# EAGLE design Mother_Board (EAGLE 6.3)

## Sheet 1 of 2
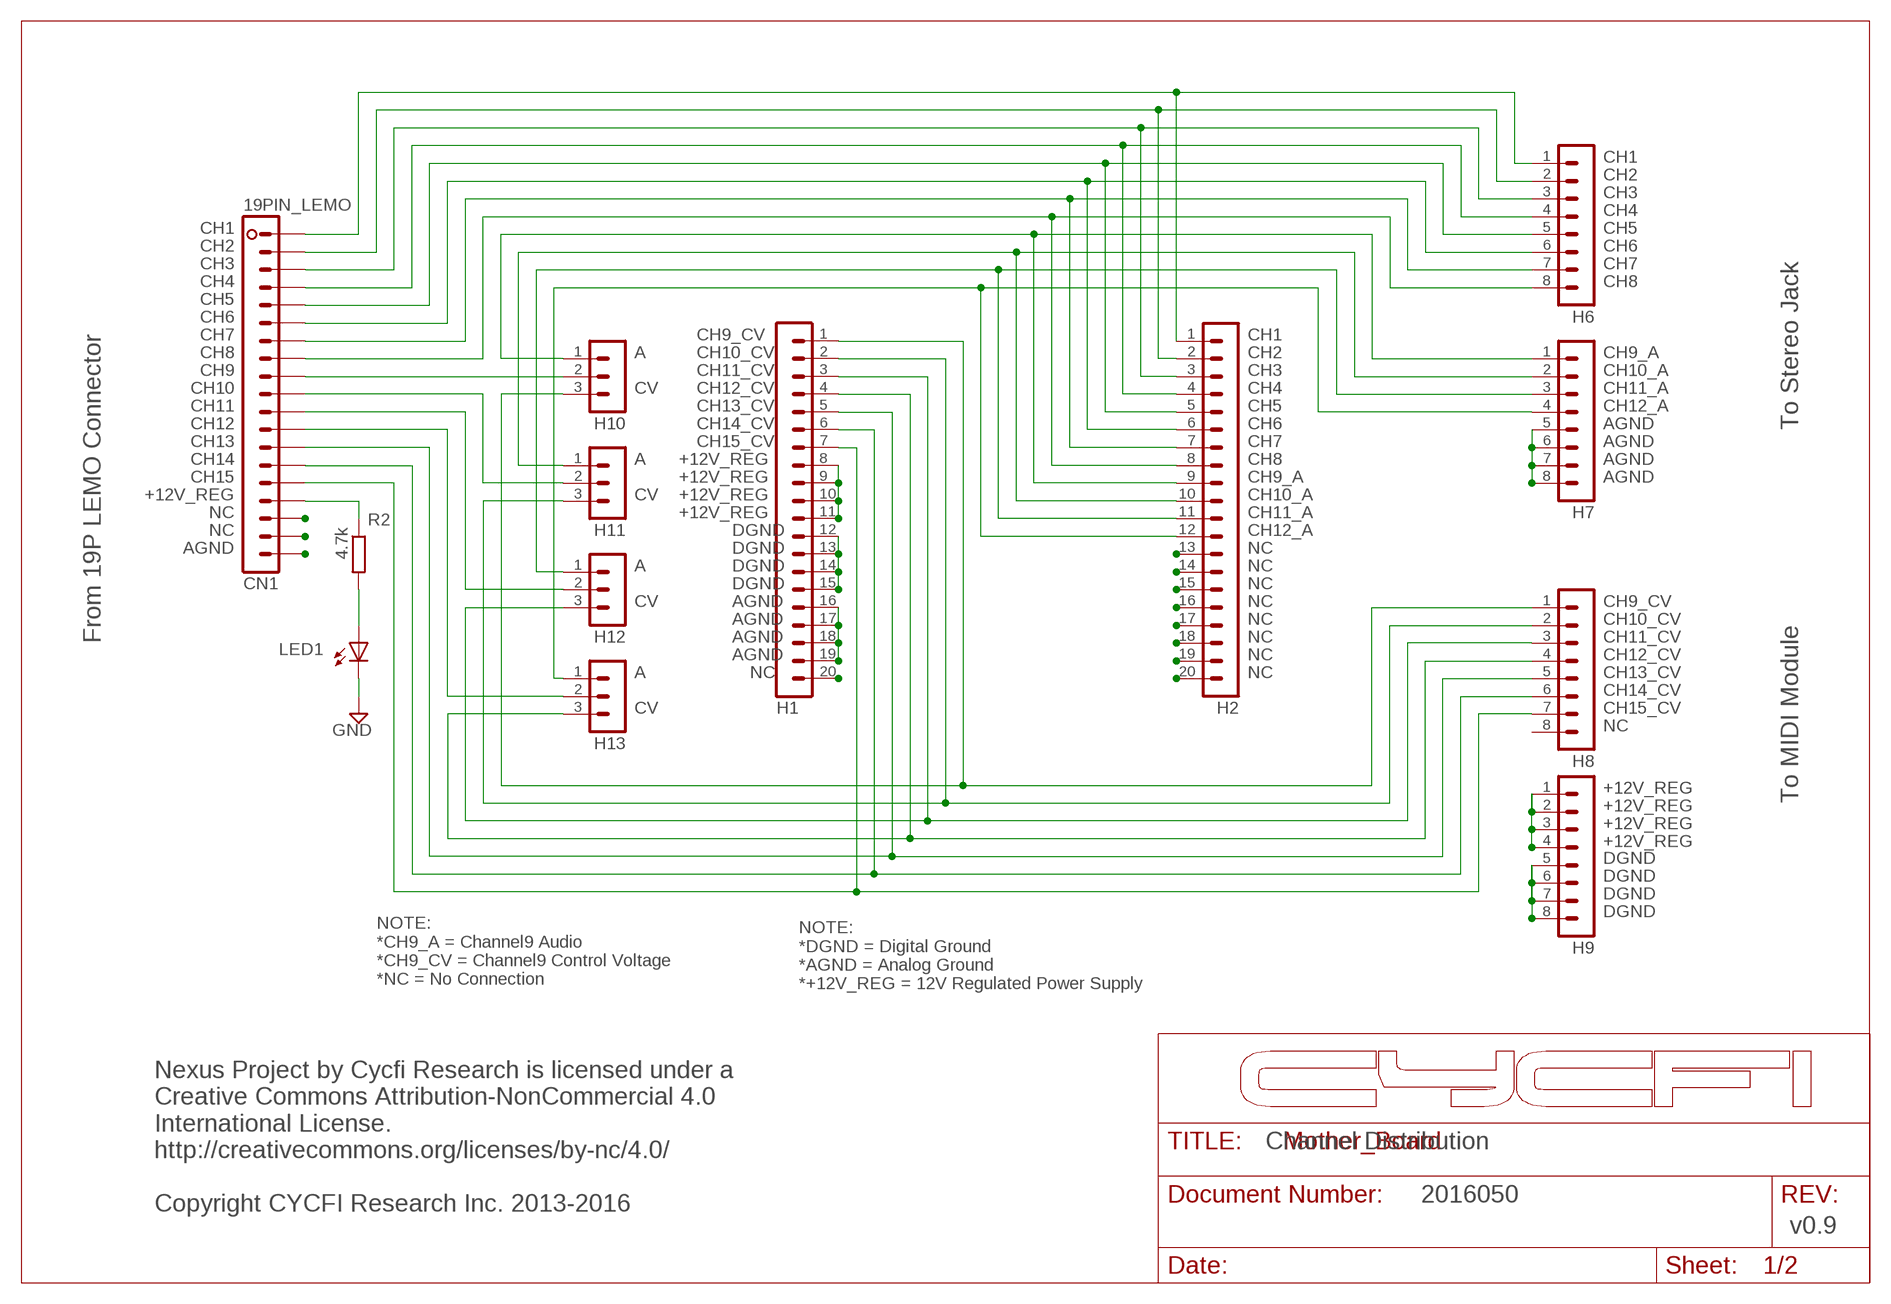
[diagram p0: schematic, sheet 1]

### Parts
CN1  19PIN_LEMO  [19PIN_LEMO]
H1  MA20-1  [MA20-1]
H2  MA20-1  [MA20-1]
H6  MA08-1  [MA08-1]
H7  MA08-1  [MA08-1]
H8  MA08-1  [MA08-1]
H9  MA08-1  [MA08-1]
H10  MA03-1_EDITED  [MA03-1_]
H11  MA03-1_EDITED  [MA03-1_]
H12  MA03-1_EDITED  [MA03-1_]
H13  MA03-1_EDITED  [MA03-1_]
LED1  LED3MM  [LED3MM]
R2  4.7k  R-EU_R0402  [R0402]

### Nets
+12V_REG: CN1.P$16 H1.8 H1.9 H1.10 H1.11 H9.1 H9.2 H9.3 H9.4 R2.1 ; also sheet 2
AGND: CN1.P$19 H1.16 H1.17 H1.18 H1.19 H7.5 H7.6 H7.7 H7.8 LED1.K(C) ; supply symbol labelled GND ; also sheet 2
DGND: H1.12 H1.13 H1.14 H1.15 H9.5 H9.6 H9.7 H9.8
N$1: H2.13
N$3: H2.14
N$4: CN1.P$1 H2.1 H6.1
N$5: CN1.P$2 H2.2 H6.2
N$6: CN1.P$3 H2.3 H6.3
N$7: CN1.P$4 H2.4 H6.4
N$8: CN1.P$5 H2.5 H6.5
N$9: CN1.P$17
N$10: CN1.P$6 H2.6 H6.6
N$11: CN1.P$7 H2.7 H6.7
N$12: CN1.P$8 H2.8 H6.8
N$13: CN1.P$9 H10.2
N$14: CN1.P$10 H11.2
N$15: CN1.P$11 H12.2
N$16: CN1.P$12 H13.2
N$17: H2.15
N$18: H2.10 H7.2 H11.1
N$19: H2.16
N$20: H2.17
N$21: H2.18
N$22: H2.19
N$23: H2.20
N$24: H1.20
N$25: LED1.A R2.2
N$26: CN1.P$18
N$28: H2.12 H7.4 H13.1
N$29: H2.11 H7.3 H12.1
N$32: H2.9 H7.1 H10.1
N$56: H1.1 H8.1 H10.3
N$57: H1.2 H8.2 H11.3
N$58: H1.3 H8.3 H12.3
N$59: H1.4 H8.4 H13.3
N$60: CN1.P$13 H1.5 H8.5
N$61: CN1.P$14 H1.6 H8.6
N$62: CN1.P$15 H1.7 H8.7
Unconnected: H8.8

### Notes on the sheet
- CH1
- CH2
- CH3
- CH4
- CH1 | CH5
- CH2 | CH6
- CH3 | CH7
- CH4 | CH8
- CH5
- CH6
- CH7 | CH9_CV | CH1
- CH8 | A | CH10_CV | CH2 | CH9_A
- CH9 | CH11_CV | CH3 | CH10_A
- CH10 | CV | CH12_CV | CH4 | CH11_A
- CH11 | CH13_CV | CH5 | CH12_A
- CH12 | CH14_CV | CH6 | AGND | To Stereo Jack
- CH13 | CH15_CV | CH7 | AGND
- CH14 | A | CH8 | AGND
- CH15 | CH9_A
- CV | CH10_A
- NC | CH11_A
- NC | CH12_A
- NC
- A | NC
- NC
- CV | NC | CH9_CV
- NC | CH10_CV
- From 19P LEMO Connector | NC | CH11_CV
- NC | CH12_CV
- A | NC | NC | CH13_CV
- CH14_CV
- CV | CH15_CV
- NC
- To MIDI Module
- DGND
- DGND
- DGND
- NOTE:
  *CH9_A = Channel9 Audio
  *CH9_CV = Channel9 Control Voltage
  *NC = No Connection
- NOTE:
  *DGND = Digital Ground
  *AGND = Analog Ground
  *+12V_REG = 12V Regulated Power Supply
- Channel Distribution
- 2016050
- Nexus Project by Cycfi Research is licensed under a 
  Creative Commons Attribution-NonCommercial 4.0 
  International License. 
  http://creativecommons.org/licenses/by-nc/4.0/
  
  Copyright CYCFI Research Inc. 2013-2016
- v0.9

## Sheet 2 of 2: Power Conditioner
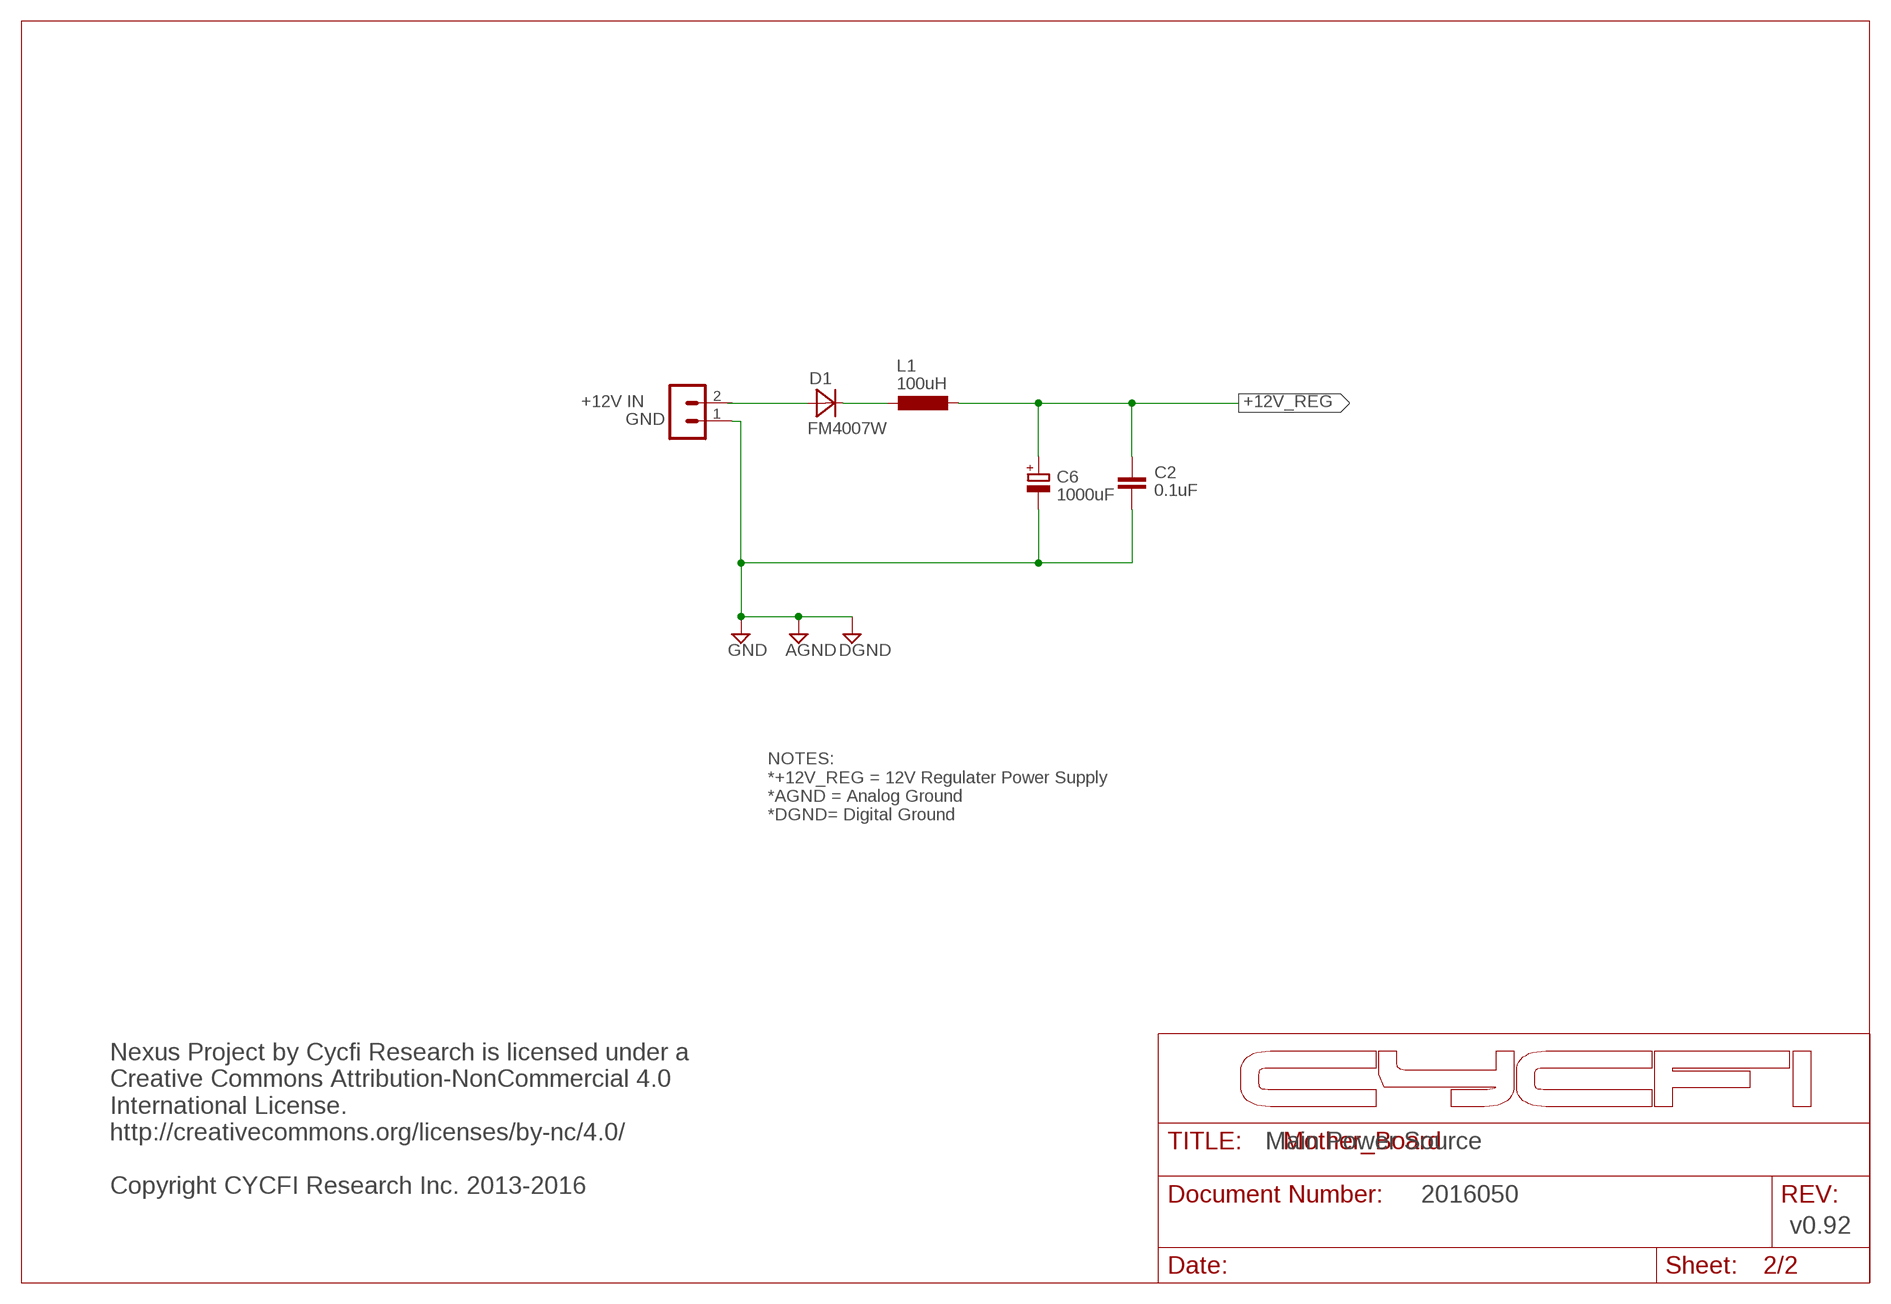
[diagram p1: schematic, sheet 2]

### Parts
C2  0.1uF  C-EUC0603  [C0603]
C6  1000uF  CPOL-EU140CLH-1010  [140CLH-1010]
D1  FM4007W  [SMX]
H14  MA02-1  [MA02-1]
L1  100uH  L-EU  [L1280]

### Nets
+12V_REG: C2.1 C6.+ L1.P$2 ; also sheet 1
AGND: C2.2 C6.- H14.1 ; supply symbol labelled GND, DGND ; also sheet 1
N$2: D1.ANODE(A) H14.2
N$31: D1.CATHODE(C) L1.P$1

### Notes on the sheet
- +12V IN
- GND
- NOTES:
  *+12V_REG = 12V Regulater Power Supply
  *AGND = Analog Ground
  *DGND= Digital Ground
- Main Power Source
- Nexus Project by Cycfi Research is licensed under a 
  Creative Commons Attribution-NonCommercial 4.0 
  International License. 
  http://creativecommons.org/licenses/by-nc/4.0/
  
  Copyright CYCFI Research Inc. 2013-2016
- 2016050
- v0.92

## Library data of the parts
C2 = resistor:C-EU: CAPACITOR, European symbol
C6 = resistor:CPOL-EU: POLARIZED CAPACITOR, European symbol
CN1 = CYCFI_Con:19PIN_LEMO
D1 = CYCFI_diode:FM4007W
H1 H2 = con-lstb:MA20-1: PIN HEADER; OC_FARNELL: unknown; OC_NEWARK: unknown
H6-H9 = con-lstb:MA08-1: PIN HEADER; OC_FARNELL: unknown; OC_NEWARK: unknown
H10-H13 = con-lstb:MA03-1: PIN HEADER
H14 = con-lstb:MA02-1
L1 = resistor:L-EU: INDUCTOR, European symbol
LED1 = led:LED: LED OSRAM: - CHIPLED LG R971, LG N971, LY N971, LG Q971, LY Q971, LO R971, LY R971 LH N974, LH R974 LS Q976, LO Q976, LY Q976 LO Q996 - Hyper CHIPLED LW Q18S LB Q993, LB Q99A, LB R99A - SideLED LS A670, LO A670, LY A670, LG A670, LP A670 LB A673, LV A673, LT A673, LW A673 LH A674 LY A675 LS A676, LA A676, LO A676, LY A676, LW A676 LS A679, LY A679, LG A679 - Hyper Micro SIDELED® LS Y876, LA Y876, LO Y876, LY Y876 LT Y87S - SmartLED LW L88C, LW L88S LB L89C, LB L89S, LG L890 LS L89K, LO L89K, LY L89K LS L896, LA L896, LO L896, LY L896 - TOPLED LS T670, LO T670, LY T670, LG T670, LP T670 LSG T670, LSP T670, LSY T670, LOP T670, LYG T670 LG T671, LOG T671, LSG T671 LB T673, LV T673, LT T673, LW T673 LH T674 LS T676, LA T676, LO T676, LY T676, LB T676, LH T676, LSB T676, LW T676 LB T67C, LV T67C, LT T67C, LS T67K, LO T67K, LY T67K, LW E67C LS E67B, LA E67B, LO E67B, LY E67B, LB E67C, LV E67C, LT E67C LW T67C LS T679, LY T679, LG T679 LS T770, LO T770, LY T770, LG T770, LP T770 LB T773, LV T773, LT T773, LW T773 LH T774 LS E675, LA E675, LY E675, LS T675 LS T776, LA T776, LO T776, LY T776, LB T776 LHGB T686 LT T68C, LB T68C - Hyper Mini TOPLED® LB M676 - Mini TOPLED Santana® LG M470 LS M47K, LO M47K, LY M47K Source: http://www.osram.convergy.de LUXEON: - LUMILED® LXK2-PW12-R00, LXK2-PW12-S00, LXK2-PW14-U00, LXK2-PW14-V00 LXK2-PM12-R00, LXK2-PM12-S00, LXK2-PM14-U00 LXK2-PE12-Q00, LXK2-PE12-R00, LXK2-PE12-S00, LXK2-PE14-T00, LXK2-PE14-U00 LXK2-PB12-K00, LXK2-PB12-L00, LXK2-PB12-M00, LXK2-PB14-N00, LXK2-PB14-P00, LXK2-PB14-Q00 LXK2-PR12-L00, LXK2-PR12-M00, LXK2-PR14-Q00, LXK2-PR14-R00 LXK2-PD12-Q00, LXK2-PD12-R00, LXK2-PD12-S00 LXK2-PH12-R00, LXK2-PH12-S00 LXK2-PL12-P00, LXK2-PL12-Q00, LXK2-PL12-R00 Source: www.luxeon.com KINGBRIGHT: KA-3528ASYC Source: www.kingbright.com
R2 = resistor:R-EU_: RESISTOR, European symbol

## Board
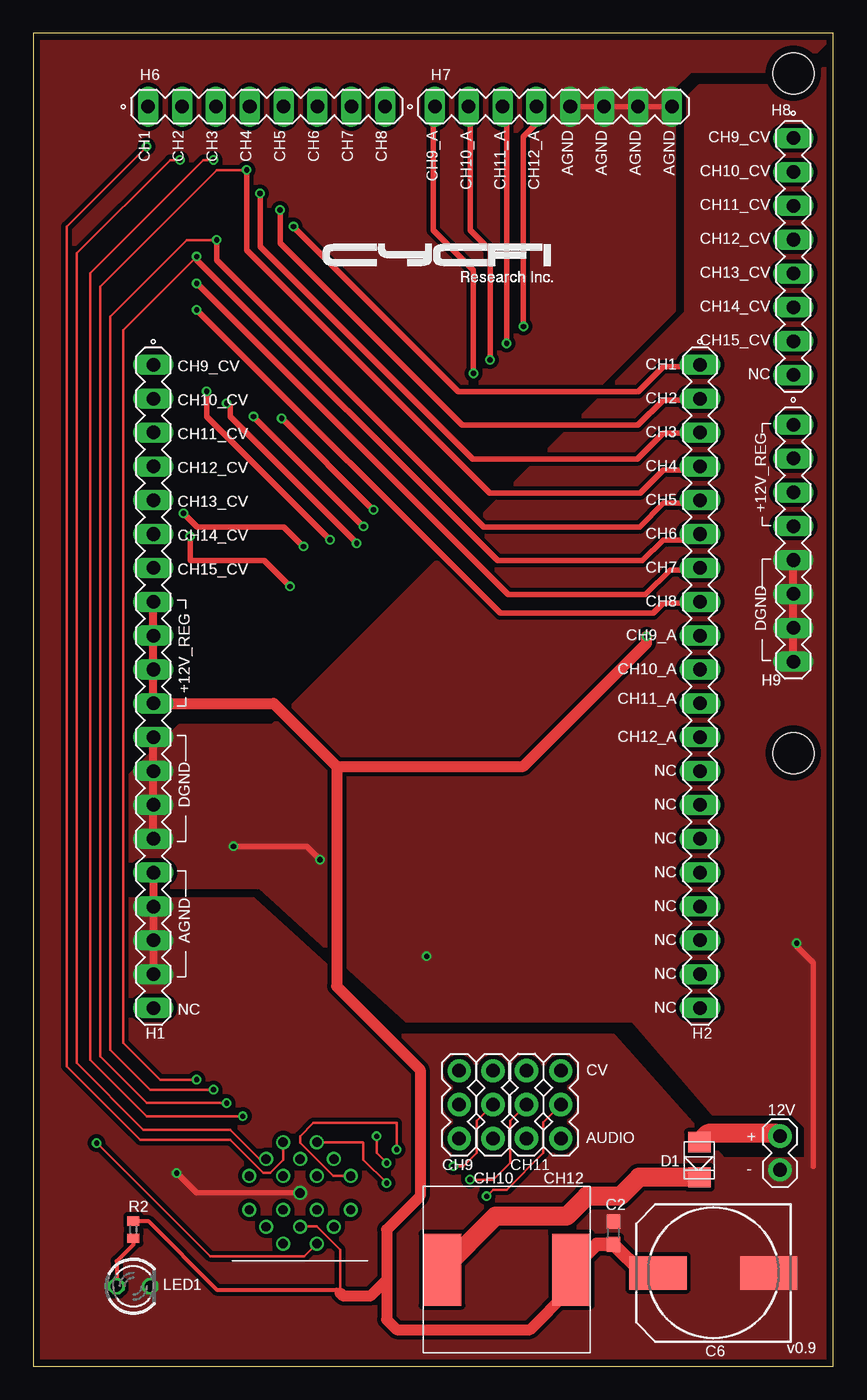
[diagram p2: board, top side]
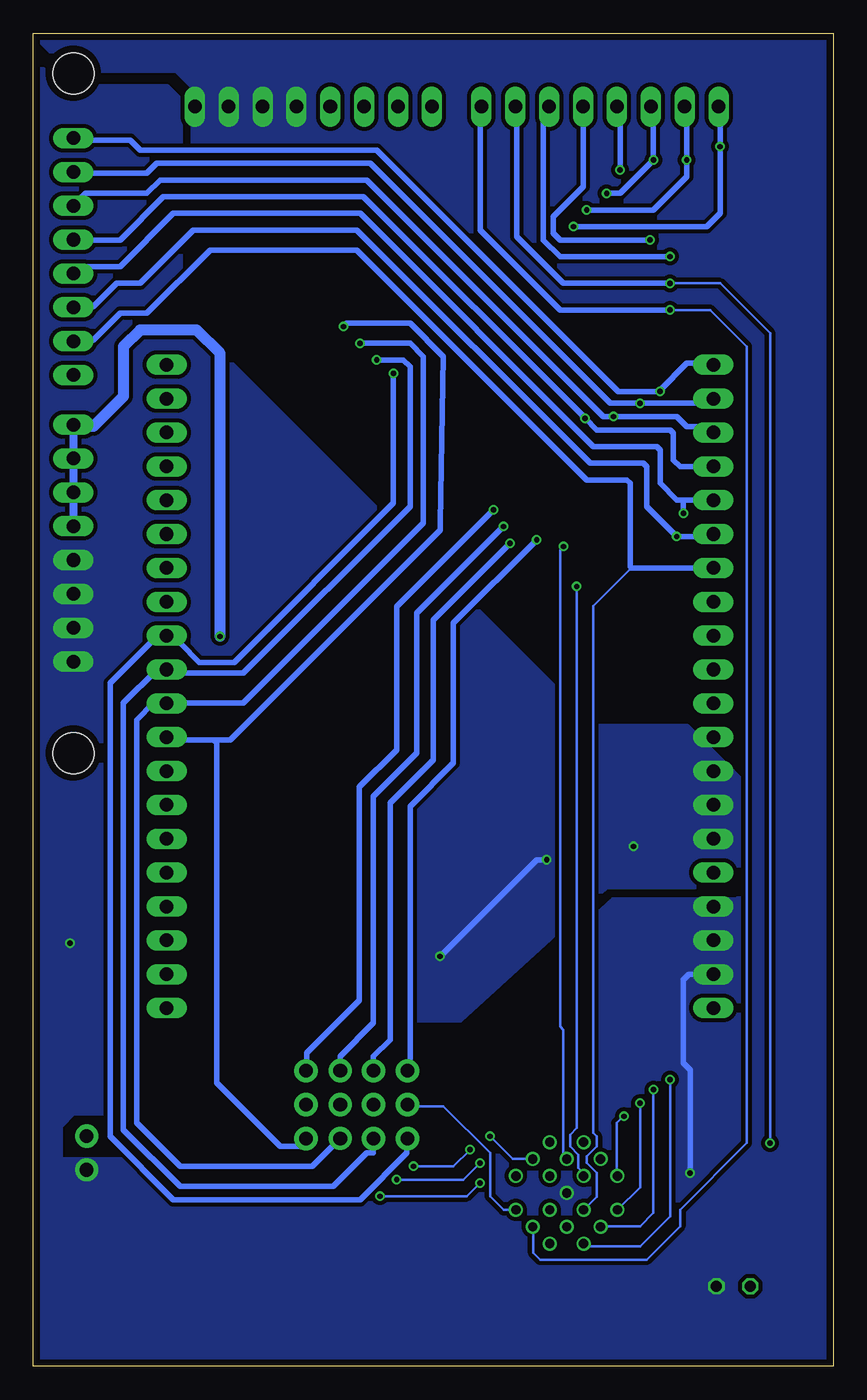
[diagram p3: board, bottom side, seen from below]

Size 60 x 100 mm. Coordinates in mm from the lower left corner, seen from the top.
Outline: 0,0 60,0 60,100 0,100 0,0
Copper layers (1*16): Top 0.035mm / dielectric 1.6mm / Bottom 0.035mm
Design rules "Elecrow_2-layer_PCB_eagle_rule": minimum track width 6mil, minimum drill 12mil, track to track 6mil, track to pad 8mil, pad to pad 12mil, via to via 12mil, smd to smd 0mil, copper to edge 20mil, drill to drill 10mil, minimum pad ring 6mil, minimum via ring 6mil, stop-mask expansion 0mil, vias tented up to drill 100mil, thermal gap 10mil
Holes 3.1 mm at 57,97 57,46

### Footprints (pad centres in the part's own frame; a part is rotated, then mirrored left to right if it is on the bottom)
C0603 = smd 1.1 x 1: 1 -0.85,0; 2 0.85,0
140CLH-1010 = smd 4.3 x 2.5: + 4.15,0; - -4.15,0
19PIN_LEMO = drill 0.7: P$1 -3.81,-1.27; P$2 -2.54,-2.54; P$3 -1.27,-3.81; P$4 1.27,-3.81; P$5 2.54,-2.54; P$6 3.81,-1.27; P$7 3.81,1.27; P$8 2.54,2.54; P$9 1.27,3.81; P$10 -1.27,3.81; P$11 -2.54,2.54; P$12 -3.81,1.27; P$13 -2.54,0; P$14 -1.27,-1.27; P$15 1.27,-1.27; P$16 2.54,0; P$17 1.27,1.27; P$18 -1.27,1.27; P$19 0,0
SMX = smd 1.52 x 1.68: ANODE 0,0; CATHODE 2.64,0
MA20-1 = drill 1.016 long: 1 -24.13,0; 2 -21.59,0; 3 -19.05,0; 4 -16.51,0; 5 -13.97,0; 6 -11.43,0; 7 -8.89,0; 8 -6.35,0; 9 -3.81,0; 10 -1.27,0; 11 1.27,0; 12 3.81,0; 13 6.35,0; 14 8.89,0; 15 11.43,0; 16 13.97,0; 17 16.51,0; 18 19.05,0; 19 21.59,0; 20 24.13,0
MA08-1 = drill 1.016 long: 1 -8.89,0; 2 -6.35,0; 3 -3.81,0; 4 -1.27,0; 5 1.27,0; 6 3.81,0; 7 6.35,0; 8 8.89,0
MA03-1_ = drill 1.016 pad 1.75: 1 -2.54,0; 2 0,0; 3 2.54,0
MA02-1 = drill 1.016 pad 1.75: 1 -1.27,0; 2 1.27,0
L1280 = smd 2.9 x 5.4: P$1 -4.85,0; P$2 4.85,0
LED3MM = drill 0.813 octagon: A -1.27,0; K 1.27,0
R0402 = smd 0.7 x 0.9: 1 -0.65,0; 2 0.65,0

### Placement (x,y rotation side)
C2  43.5,10 90 top
C6  51,7 180 top
CN1  20,13 270 top
D1  49.95,16.82 270 top
H1  9,51 270 top
H2  50,51 270 top
H6  17.5,94.5 0 top
H7  39,94.5 0 top
H8  57,83.25 270 top
H9  57,61.75 270 top
H10  31.94,19.62 90 top
H11  34.48,19.62 90 top
H12  36.98,19.63 90 top
H13  39.56,19.62 90 top
H14  56,16 90 top
L1  35.5,7.25 0 top
LED1  7.5,6 0 top
R2  7.5,10.25 270 top

### Tracks (layer width: path | path; a pad name or v marks a point on that pad's centre or on a via)
+12V_REG  (via drill 0.4)
  Top 0.203: 23,5.5 23,8.75 21.25,10.5 20.04,10.5 CN1.P$16
  Top 0.305: R2.1 8.6,10.9 13.75,5.75 22.75,5.75 23,5.5
  Top 0.406: R2.1 7.35,10.9
  Top 0.61: H1.11 H1.10 H1.9 H1.8 | L1.P$2 40.35,5.85 40.12,5.62
  Top 0.813: H1.11 18.02,49.73 22.75,45 | 22.75,45 22.75,28.5 29,22.25 29,12.75 26.5,10.25 26.5,6.5 | 26.5,6.5 26.5,3.5 27.25,2.75 37.25,2.75 40.12,5.62 | 26.5,6.5 25.25,5.25 23.25,5.25 23,5.5 | 22.75,45 36.75,45 46,54.25 v46,54.75
  Top 1.016: C6.+ 45.65,7 C2.1 42.25,9.15 L1.P$2
  Bottom 0.61: H9.1 H9.2 H9.3 H9.4
  Bottom 0.813: v46,54.75 46,76 47.75,77.75 52,77.75 53.25,76.5 53.25,72.75 55.5,70.5 56.86,70.5 H9.1
AGND  (via drill 0.4)
  Top 0.406: H7.8 H7.7 H7.6 H7.5 | v10.75,14.5 12.25,13 CN1.P$19
  Top 0.61: H1.16 H1.17 H1.18 H1.19
  Bottom 0.406: H1.19 10.84,29.41 11.25,29 11.25,22.75 10.75,22.25 v10.75,14.5
  pour Bottom (isolate 0.305, no thermals): 60,100 0,100 0,0 60,0 60,15.5 51.75,15.5 43.5,24.75 27.75,24.75 16.5,35 7.25,35 6,36.25 6,44.75 10.5,49.25 18,49.25 48,79.25 48,96 49.25,97.25 57.25,97.25
  pour Top (isolate 0.305, no thermals): 60,100 0,100 0,0 60,0 60,15.5 51.75,15.5 43.5,24.75 27.75,24.75 16.5,35 7.25,35 6,36.25 6,44.75 10.5,49.25 18,49.25 48,79.25 48,96 49.25,97.25 57.25,97.25
DGND  (via drill 0.4)
  Top 0.406: 58.5,15 58.5,30.25 57.25,31.5 v57.25,31.75 | v15,39 20.5,39 v21.5,38
  Top 0.61: H1.15 H1.14 H1.13 H1.12 | H9.8 H9.7 H9.6 H9.5
  Bottom 0.406: v21.5,38 22.25,38 v29.5,30.75
  pour Top (isolate 0.305, no thermals): 60,98 58,96 50,96 49,95 49,79 18,48 11,48 7,44 7,37 8,36 17,36 28,26 45,26 51,19 57,19 58,18 58,14 60,14
  pour Bottom (isolate 0.305, no thermals): 60,98 58,96 50,96 49,95 49,79 18,48 11,48 7,44 7,37 8,36 17,36 28,26 45,26 51,19 57,19 58,18 58,14 60,14
N$2
  Top 1.016: 55.81,17.46 H14.2
  Top 1.422: 55.81,17.46 50.6,17.46 D1.ANODE
N$4  (via drill 0.4)
  Top 0.203: v8.5,91.5 2.5,85.5 2.5,22.5 8,17 14.75,17 17.25,14.5 17.75,14.5 18.75,15.5 18.75,16.79 CN1.P$1
  Top 0.406: v19.5,85.5 31.87,73.13 45.38,73.13 47.25,75 49.87,75 H2.1
  Bottom 0.406: v19.5,85.5 9.5,85.5 8.5,86.5 v8.5,91.5 8.5,94.39 H6.1
N$5  (via drill 0.4)
  Top 0.203: v11,90.5 10.25,90.5 3.25,83.5 3.25,22.75 8.25,17.75 14.75,17.75 17,15.5 17.42,15.5 CN1.P$2
  Top 0.406: v18.5,86.75 18.5,84.25 32.16,70.59 45.34,70.59 47.25,72.5 49.91,72.5 H2.2
  Bottom 0.406: v18.5,86.75 13.5,86.75 11,89.25 v11,90.5 11,94.35 H6.2
N$6  (via drill 0.4)
  Top 0.203: v13.5,90.5 12.75,90.5 4.25,82 4.25,23 8.5,18.75 v15.71,18.75
  Top 0.406: v17,88 17,84 32.95,68.05 45.3,68.05 47.25,70 49.95,70 H2.3
  Bottom 0.203: v15.71,18.75 15.75,18.75 16.25,18.25 16.25,14.33 CN1.P$3
  Bottom 0.406: v17,88 16,88 v13.5,90.5 13.5,94.31 H6.3
N$7  (via drill 0.4)
  Top 0.203: v14.5,19.75 8.5,19.75 5,23.25 5,81 13.75,89.75 v16,89.75
  Top 0.406: v16,89.75 16,83.75 34.24,65.51 45.51,65.51 47.25,67.25 49.74,67.25 H2.4
  Bottom 0.203: v14.5,19.75 14.5,13.42 CN1.P$4
  Bottom 0.406: v16,89.75 16,94.27 H6.4
N$8  (via drill 0.4)
  Top 0.203: v13.5,20.75 8.75,20.75 5.75,23.75 5.75,78.75 11.5,84.5 v13.75,84.5
  Top 0.406: v13.75,84.5 13.75,83 33.78,62.97 45.47,62.97 47.25,64.75 49.78,64.75 H2.5
  Bottom 0.203: v13.5,20.75 13.5,11.5 14.5,10.5 17.42,10.5 CN1.P$5
  Bottom 0.406: v13.75,84.5 20.5,84.5 21,85 21,86.25 18.75,88.5 18.75,94.48 H6.5
N$10  (via drill 0.4)
  Top 0.203: v12.25,21.5 9.5,21.5 6.75,24.25 6.75,77.75 v12.25,83.25
  Top 0.406: v12.25,83.25 12.25,83 34.82,60.43 45.68,60.43 47.25,62 49.57,62 H2.6
  Bottom 0.203: v12.25,21.5 12.25,11.25 14.5,9 18.54,9 CN1.P$6
  Bottom 0.406: v12.25,83.25 20.5,83.25 21.75,84.5 21.75,94.06 H6.6
N$11  (via drill 0.4)
  Top 0.203: v4.75,16.75 13.25,8.25 20.33,8.25 CN1.P$7
  Top 0.406: v12.25,81.25 35.61,57.89 45.89,57.89 47.75,59.75 49.86,59.75 H2.7
  Bottom 0.203: v4.75,16.75 4.75,77.5 8.5,81.25 v12.25,81.25
  Bottom 0.406: v12.25,81.25 20.25,81.25 23.75,84.75 23.75,94.4 H6.7
N$12  (via drill 0.4)
  Top 0.406: H2.8 49.9,57.25 47.25,57.25 46.5,56.5 35,56.5 v12.25,79.25
  Bottom 0.203: v12.25,79.25 9.25,79.25 6.5,76.5 6.5,16.75 11.5,11.75 11.5,10.5 14,8 22,8 22.5,8.5 22.5,10.42 CN1.P$8
  Bottom 0.406: v12.25,79.25 20.5,79.25 26.5,85.25 26.5,94.39 H6.8
N$13
  Bottom 0.203: CN1.P$9 24.73,11.73 25.75,12.75 25.75,16 29.25,19.5 31.82,19.5 H10.2
N$14  (via drill 0.4)
  Top 0.203: CN1.P$10 22.48,14.27 20,16.75 20,17.25 21,18.25 27.25,18.25 v27.25,16.25 | H11.2 33.25,18.39 33.25,16 32.25,15 v31.5,15
  Bottom 0.203: v31.5,15 28.5,15 v27.25,16.25
N$15  (via drill 0.4)
  Top 0.203: H12.2 35.75,18.4 35.75,15.25 34.5,14 v32.75,14 | v26.5,15.25 25.75,16 v25.75,17.25
  Bottom 0.203: CN1.P$11 24.04,15.54 v25.75,17.25 | v32.75,14 27.75,14 v26.5,15.25
N$16  (via drill 0.4)
  Top 0.203: CN1.P$12 24.69,16.81 24.75,16.75 24.75,15.5 v26.5,13.75 | H13.2 38.25,18.31 38.25,16 35.5,13.25 34.5,13.25 v34,12.75
  Bottom 0.203: v34,12.75 27.5,12.75 v26.5,13.75
N$18  (via drill 0.4)
  Top 0.406: v34.25,75.5 34.25,83.75 32.75,85.25 32.75,94.4 H7.2
  Bottom 0.406: v34.25,75.5 32.25,75.5 31.75,75 31.75,64.5 44.25,52 49.73,52 H2.10 50.02,52.25 50.75,52.25 53.25,49.75 53.25,17.75 49,13.5 37.5,13.5 35,16 34.5,16 34.5,17.06 H11.1
N$25
  Top 0.305: R2.2 7.5,9.12 6.25,7.88 6.25,6.02 LED1.A
N$28  (via drill 0.4)
  Top 0.406: v36.75,78 36.75,92.25 37.75,93.25 37.75,94.48 H7.4
  Bottom 0.406: v36.75,78 36.5,78.25 31.75,78.25 29.25,75.75 29.5,63.25 29.5,62.75 45.25,47 46.5,47 | 46.5,47 49.81,47 H2.12 | 46.5,47 46.25,46.75 46.25,21.25 41.5,16.5 40.14,16.5 H13.1
N$29  (via drill 0.4)
  Top 0.406: v35.5,76.75 35.5,94.19 H7.3
  Bottom 0.406: v35.5,76.75 31.75,76.75 30.75,75.75 30.75,63.25 44.25,49.75 49.98,49.75 H2.11 50.02,49.75 51,49.75 52.25,48.5 52.25,18.25 49,15 39.07,15 H12.1
N$31
  Top 1.422: D1.CATHODE 45.42,14.18 44,12.75 41.5,12.75 40,11.25 34.65,11.25 L1.P$1
N$32  (via drill 0.4)
  Top 0.406: v33,74.5 33,82.25 30,85.25 30,94.39 H7.1
  Bottom 0.406: v33,74.5 33,64.75 44.94,52.81 47.56,52.81 49,54.25 49.44,54.25 H2.9 50.06,54.75 50.75,54.75 54.25,51.25 54.25,17.25 49.5,12.5 35.5,12.5 32,16 32,17.02 H10.1
N$56  (via drill 0.4)
  Top 0.406: v22.25,62 13,71.25 v13,73.13
  Bottom 0.406: H8.1 56.86,92 52.75,92 52,91.25 34.25,91.25 16.13,73.13 v13,73.13 13,73.25 11,75.25 9.12,75.25 H1.1 | v22.25,62 28.5,55.75 28.5,45.25 31.75,42 31.75,22.35 H10.3
N$57  (via drill 0.4)
  Top 0.406: v24.25,61.75 14.75,71.25 14.75,72 v14.5,72.25
  Bottom 0.406: H8.2 56.9,89.5 51.5,89.5 50.75,90.25 34.75,90.25 16.75,72.25 v14.5,72.25 9.34,72.25 H1.2 | v24.25,61.75 30,56 30,45.5 33.25,42.25 33.25,24.5 34.5,23.25 34.5,22.18 H11.3
N$58  (via drill 0.4)
  Top 0.406: v24.75,63 v16.5,71.25
  Bottom 0.406: v24.75,63 31.25,56.5 31.25,46 34.5,42.75 34.5,25.75 37,23.25 37,22.19 H12.3 | H1.3 9.45,70.5 11,70.5 11.75,71.25 v16.5,71.25 17.25,71.25 35,89 50.5,89 51.5,88 56.06,88 H8.3
N$59  (via drill 0.4)
  Top 0.406: v25.5,64.25 v18.62,71.12
  Bottom 0.406: v25.5,64.25 32.75,57 32.75,46.25 35.56,43.44 35.56,27.44 39.5,23.5 39.5,22.22 H13.3 | H1.4 11.5,67.5 12,68 12,70 12.25,70.25 17.75,70.25 v18.62,71.12 35.25,87.75 50.25,87.75 53.5,84.5 56.98,84.5 H8.4
N$60  (via drill 0.4)
  Top 0.406: v20.25,61.5 18.78,62.97 12.28,62.97 v11.25,64
  Bottom 0.203: CN1.P$13 20.25,15.79 20.25,24.25 20.25,25.25 20.5,25.5 20.5,61.25 v20.25,61.5
  Bottom 0.406: 56.98,82 H8.5 56.48,82.5 53.5,82.5 49.5,86.5 35.5,86.5 18,69 13.25,69 13,68.75 13,66.25 11.75,65 11.25,65 | 11.25,65 9.03,65 H1.5 | v11.25,64 11.25,65
N$61  (via drill 0.4)
  Top 0.406: v19.25,58.5 17.32,60.43 11.82,60.43 11.75,60.5 v11.75,62.25
  Bottom 0.203: CN1.P$14 18.75,14.29 18.75,14.5 19.12,14.88 19.12,15.88 19.75,16.5 19.75,17.38 19.25,17.88 19.25,23.25 19.25,23.75 v19.25,58.5
  Bottom 0.406: H1.6 9.18,62.25 v11.75,62.25 14,64.5 14,67.5 14.25,67.75 18.25,67.75 35.75,85.25 48,85.25 52,81.25 53.75,81.25 55.5,79.5 56.94,79.5 H8.6
N$62
  Bottom 0.203: CN1.P$15 17.75,12.71 17.75,14.5 18.5,15.25 18.5,15.75 17.75,16.5 17.75,17.25 18,17.5 18,57.03 15.14,59.89
  Bottom 0.406: H1.7 15.14,59.89 15.25,60 15.25,66.25 15.5,66.5 18.5,66.5 35.75,83.75 46.75,83.75 51.5,79 53.5,79 55.5,77 56.9,77 H8.7

### Text on the board
tNames: CH1 | CH2 | CH3 | CH4 | CH5 | CH6 | CH7 | CH8 | CH9_A | CH10_A | CH11_A | CH12_A | AGND | AGND | AGND | AGND | CH9_CV | CH10_CV | CH11_CV | CH12_CV | CH13_CV | CH14_CV | CH15_CV | CH1 | CH9_CV | NC | CH2 | CH10_CV | CH11_CV | CH3 | CH4 | CH12_CV | CH5 | CH13_CV | +12V_REG | CH6 | CH14_CV | CH7 | CH15_CV | CH8 | CH9_A | DGND | CH10_A | +12V_REG | CH11_A | CH12_A | NC | NC | DGND | NC | NC | NC | AGND | NC | NC | NC | NC | CV | 12V | AUDIO | + | CH9 | CH11 | CH10 | CH12 | - | v0.9
_tPlace: D1
_tNames: H6 | H7 | H8 | CH1 | CH2 | CH3 | CH4 | CH5 | CH6 | CH7 | CH8 | CH9_A | CH10_A | CH11_A | CH12_A | AGND | AGND | AGND | AGND | CH9_CV | CH10_CV | CH11_CV | CH12_CV | CH13_CV | CH14_CV | CH15_CV | CH1 | CH9_CV | NC | CH2 | CH10_CV | CH11_CV | CH3 | CH4 | CH12_CV | CH5 | CH13_CV | +12V_REG | CH6 | CH14_CV | CH7 | CH15_CV | CH8 | CH9_A | DGND | CH10_A | H9 | +12V_REG | CH11_A | CH12_A | NC | NC | DGND | NC | NC | NC | AGND | NC | NC | NC | NC | H1 | H2 | CV | 12V | AUDIO | + | CH9 | CH11 | CH10 | CH12 | - | R2 | C2 | LED1 | C6 | v0.9